# Altium schematic sheet relay.SchDoc
size A4
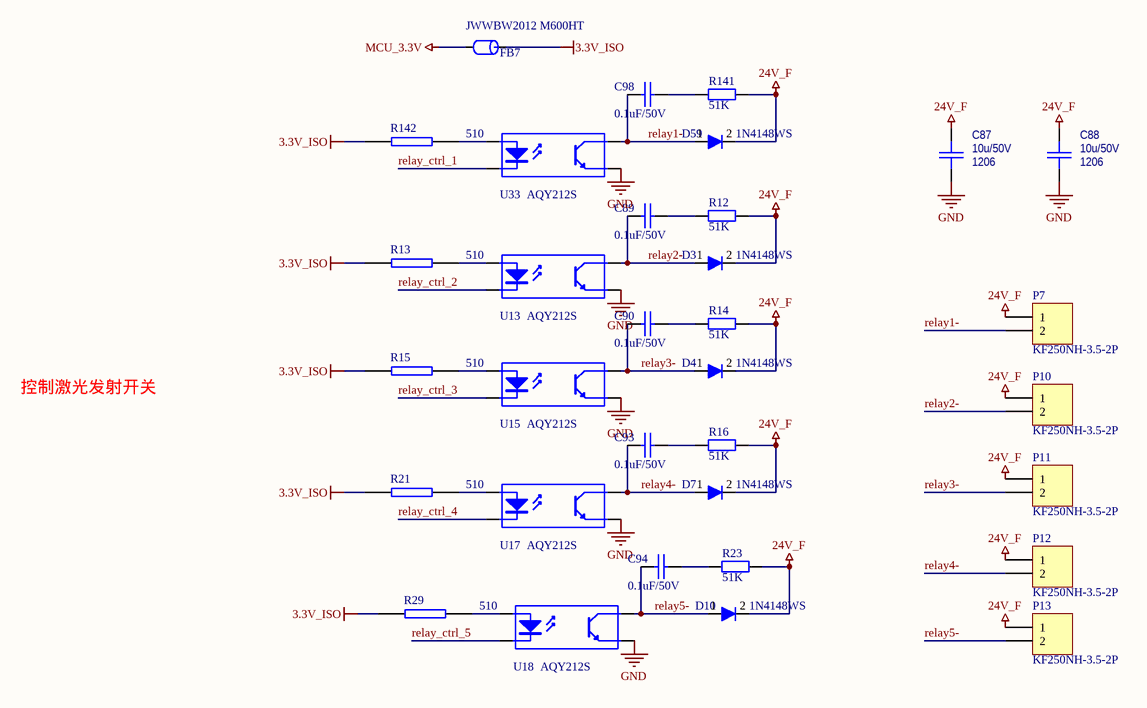
[diagram p0: relay.SchDoc]

## Parts
C87  Package: 1206  [CAPC3216X156N_1206]  (hidden comment: 10u/50V)
C88  Package: 1206  [CAPC3216X156N_1206]  (hidden comment: 10u/50V)
C89  0.1uF/50V  [CAPC1608X092N_0603]
C90  0.1uF/50V  [CAPC1608X092N_0603]
C93  0.1uF/50V  [CAPC1608X092N_0603]
C94  0.1uF/50V  [CAPC1608X092N_0603]
C98  0.1uF/50V  [CAPC1608X092N_0603]
D3  1N4148WS  [SOD323]
D4  1N4148WS  [SOD323]
D7  1N4148WS  [SOD323]
D10  1N4148WS  [SOD323]
D59  1N4148WS  [SOD323]
FB7  JWWBW2012 M600HT  [0805CZ]
P7  KF250NH-3.5-2P  [KF250NH-3.5-2P]
P10  KF250NH-3.5-2P  [KF250NH-3.5-2P]
P11  KF250NH-3.5-2P  [KF250NH-3.5-2P]
P12  KF250NH-3.5-2P  [KF250NH-3.5-2P]
P13  KF250NH-3.5-2P  [KF250NH-3.5-2P]
R12  51K  [RESC1608X055N_0603]
R13  510  [RESC1608X055N_0603]
R14  51K  [RESC1608X055N_0603]
R15  510  [RESC1608X055N_0603]
R16  51K  [RESC1608X055N_0603]
R21  510  [RESC1608X055N_0603]
R23  51K  [RESC1608X055N_0603]
R29  510  [RESC1608X055N_0603]
R141  51K  [RESC1608X055N_0603]
R142  510  [RESC1608X055N_0603]
U13  AQY212S  [sop4]
U15  AQY212S  [sop4]
U17  AQY212S  [sop4]
U18  AQY212S  [sop4]
U33  AQY212S  [sop4]

## Nets
3.3V_ISO: FB7.1 R13.2 R15.2 R21.2 R29.2 R142.2
24V_F: C87.1 C88.1 D3.2(A) D4.2(A) D7.2(A) D10.2(A) D59.2(A) P7.1 P10.1 P11.1 P12.1 P13.1 R12.2 R14.2 R16.2 R23.2 R141.2
GND: C87.2 C88.2 U13.3(E) U15.3(E) U17.3(E) U18.3(E) U33.3(E)
MCU_3.3V: FB7.2
relay1-: C98.1 D59.1(K) P7.2 U33.4(C)
relay2-: C89.1 D3.1(K) P10.2 U13.4(C)
relay3-: C90.1 D4.1(K) P11.2 U15.4(C)
relay4-: C93.1 D7.1(K) P12.2 U17.4(C)
relay5-: C94.1 D10.1(K) P13.2 U18.4(C)
relay_ctrl_1: U33.2(K)
relay_ctrl_2: U13.2(K)
relay_ctrl_3: U15.2(K)
relay_ctrl_4: U17.2(K)
relay_ctrl_5: U18.2(K)
NetC89_2: C89.2 R12.1
NetC90_2: C90.2 R14.1
NetC93_2: C93.2 R16.1
NetC94_2: C94.2 R23.1
NetC98_2: C98.2 R141.1
NetR13_1: R13.1 U13.1(A)
NetR15_1: R15.1 U15.1(A)
NetR21_1: R21.1 U17.1(A)
NetR29_1: R29.1 U18.1(A)
NetR142_1: R142.1 U33.1(A)

## Notes on the sheet
- 控制激光发射开关

## Library data of the parts
C87 C88 = Capacitor_1206: PartNumber: CL31A106KBHNNNE; Tolerance: [tol]; TempCo: [tempco]; Voltage Rating: [voltage]; Power Rating: *; Value: 10u/50V; SupplierDescription: CAP CER 10UF 25V X5R 1206
C89 C90 C93 C94 C98 = CAP: PartNumber: CC0603KRX7R9BB104; Value: 0.1uF/50V; Package: 0603
D3 D4 D7 D10 D59 = LL4148: 版本: V1.00; 名称: 快速开关二极管; 物料编号: APLLY; 制造商: VISHAY; Value: 1N4148WS; PartNumber: 1N4148WS
FB7 = FB: Part Field 1: 磁珠/0603/1K ohm/100MHz; PartNumber: BLM21PG221SN1D; Text Field1: FB; Value: JWWBW2012 M600HT; Package: 0805
P7 P10-P13 = Header 2: Publisher: Altium Limited; Value: KF250NH-3.5-2P; PartNumber: KF250NH-3.5-2P
R12 R14 R16 R23 R141 = Res0805M: PartNumber: RC0603FR-0751KL; Value: 51K; Package: 0603
R13 R15 R21 R29 R142 = RES2: PartNumber: RC0603FR-07510RL; Value: 510; Package: 0603
U13 U15 U17 U18 U33 = Optoisolator1: Published: 24-Mar-1999; PackageReference: DIP-4; Publisher: Altium Limited; Value: AQY212S; PartNumber: AQY212S